# EAGLE schematic NavCom_Board_3 (EAGLE 7.2.0)
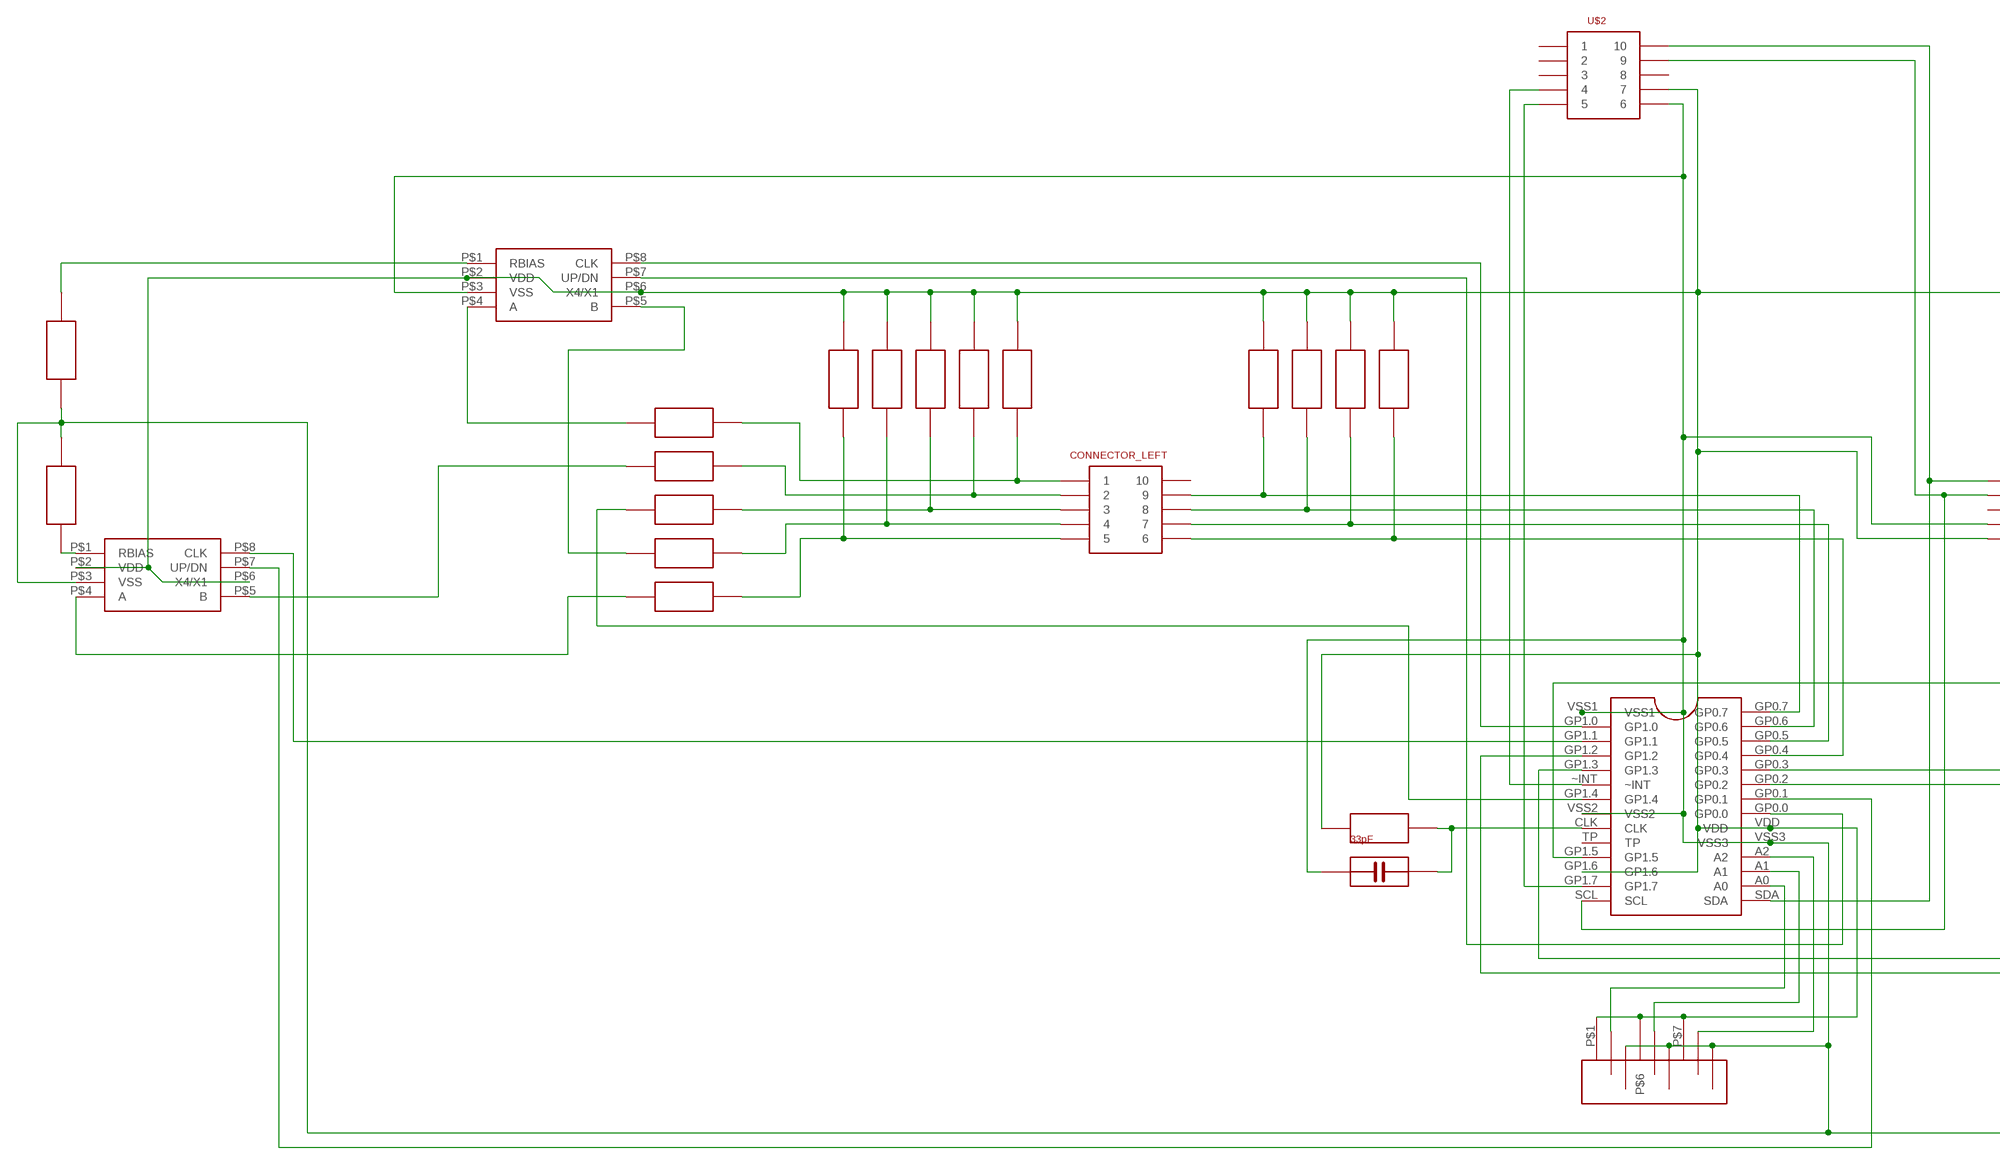
[diagram p0: schematic, sheet 1, part 1 of 2]
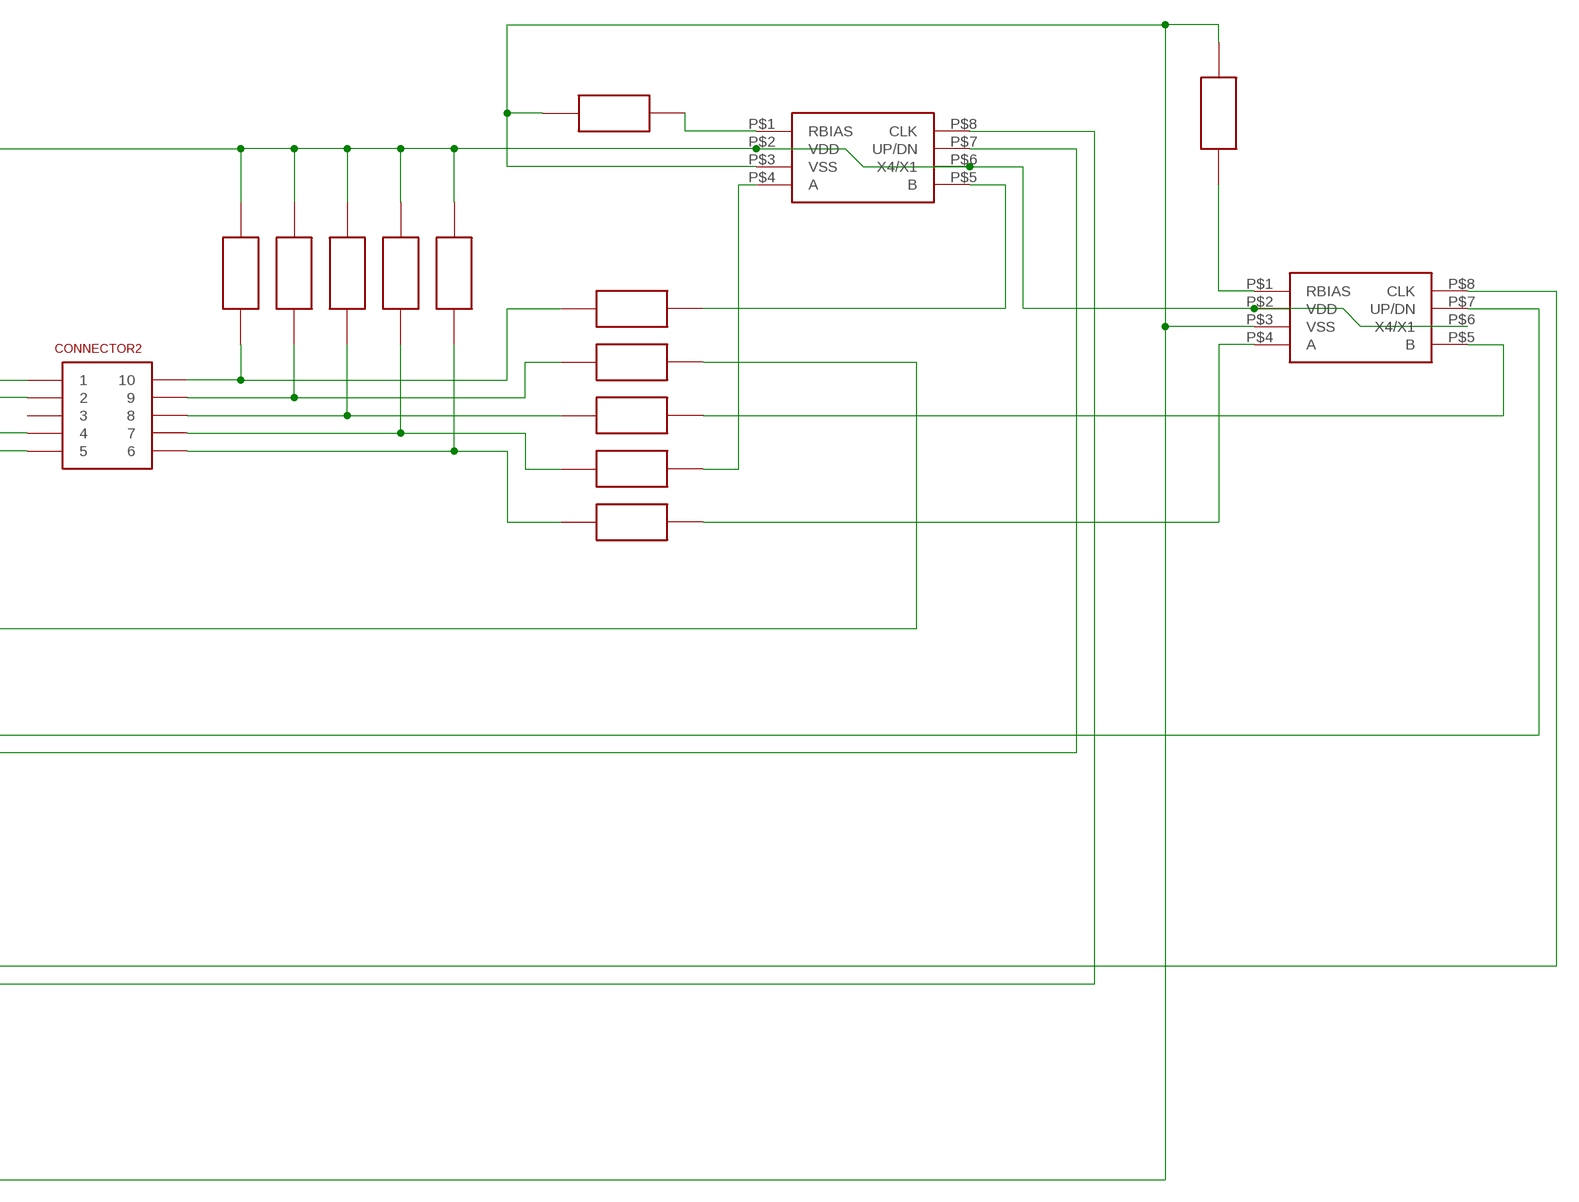
[diagram p1: schematic, sheet 1, part 2 of 2]

## Parts
33PF  33pF  KONDENZATOR  [KONDENZATOR]
CONNECTOR2  LISTA_2X5  [LISTA_2X5]
CONNECTOR_LEFT  LISTA_2X5  [LISTA_2X5]
U$1  MCP23016  [MCP23016]
U$2  LISTA_2X5  [LISTA_2X5]
U$3  LS7084  [LS7084]
U$4  LS7084  [LS7084]
U$5  LS7084  [LS7084]
U$6  LS7084  [LS7084]
U$7  REZISTOR  [REZISTOR]
U$8  REZISTOR  [REZISTOR]
U$9  REZISTOR  [REZISTOR]
U$10  REZISTOR  [REZISTOR]
U$11  ADRESA_0..2  [ADRESA_0..2]
U$12  REZISTOR  [REZISTOR]
U$13  REZISTOR  [REZISTOR]
U$14  REZISTOR  [REZISTOR]
U$15  REZISTOR  [REZISTOR]
U$16  REZISTOR  [REZISTOR]
U$17  REZISTOR  [REZISTOR]
U$18  REZISTOR  [REZISTOR]
U$19  REZISTOR  [REZISTOR]
U$20  REZISTOR  [REZISTOR]
U$21  REZISTOR  [REZISTOR]
U$22  REZISTOR  [REZISTOR]
U$23  3.9k  REZISTOR  [REZISTOR]
U$27  470M  REZISTOR  [REZISTOR]
U$29  REZISTOR  [REZISTOR]
U$30  REZISTOR  [REZISTOR]
U$31  REZISTOR  [REZISTOR]
U$32  REZISTOR  [REZISTOR]
U$33  REZISTOR  [REZISTOR]
U$34  470M  REZISTOR  [REZISTOR]
U$35  REZISTOR  [REZISTOR]
U$36  REZISTOR  [REZISTOR]
U$38  REZISTOR  [REZISTOR]
U$39  REZISTOR  [REZISTOR]
U$40  470M  REZISTOR  [REZISTOR]
U$41  470M  REZISTOR  [REZISTOR]

## Nets
N$1: CONNECTOR2.10 U$7.P$1 U$29.P$2
N$2: CONNECTOR2.9 U$9.P$1 U$30.P$2
N$3: CONNECTOR2.8 U$10.P$1 U$31.P$2
N$4: CONNECTOR2.6 U$12.P$1 U$33.P$2
N$5: U$5.P$4(A) U$33.P$1
N$6: CONNECTOR2.7 U$17.P$1 U$32.P$2
N$7: 33PF.P$1 CONNECTOR2.4 U$1.VSS1 U$1.VSS2 U$1.VSS3 U$2.6 U$3.P$3(VSS) U$4.P$3(VSS) U$5.P$3(VSS) U$6.P$3(VSS) U$11.P$3 U$11.P$4 U$11.P$9 U$27.P$2 U$34.P$1 U$40.P$1 U$41.P$1
N$8: CONNECTOR2.5 U$1.GP1.6 U$1.VDD U$2.7 U$3.P$2(VDD) U$3.P$6(X4/X1) U$4.P$2(VDD) U$4.P$6(X4/X1) U$5.P$2(VDD) U$5.P$6(X4/X1) U$6.P$2(VDD) U$6.P$6(X4/X1) U$7.P$2 U$8.P$1 U$9.P$2 U$10.P$2 U$11.P$1 U$11.P$6 U$11.P$7 U$12.P$2 U$13.P$1 U$14.P$1 U$15.P$1 U$16.P$1 U$17.P$2 U$18.P$1 U$19.P$1 U$20.P$1 U$21.P$1 U$23.P$1
N$9: CONNECTOR_LEFT.1 U$16.P$2 U$35.P$2
N$10: CONNECTOR_LEFT.2 U$13.P$2 U$36.P$2
N$11: U$1.GP1.4 U$22.P$1
N$12: CONNECTOR_LEFT.4 U$15.P$2 U$38.P$2
N$13: CONNECTOR_LEFT.5 U$18.P$2 U$39.P$2
N$14: U$6.P$4(A) U$39.P$1
N$15: U$4.P$4(A) U$32.P$1
N$16: CONNECTOR_LEFT.9 U$1.GP0.7 U$8.P$2
N$17: U$5.P$5(B) U$31.P$1
N$18: U$1.GP1.5 U$30.P$1
N$19: U$4.P$5(B) U$29.P$1
N$20: U$3.P$4(A) U$35.P$1
N$21: CONNECTOR_LEFT.3 U$14.P$2 U$22.P$2
N$22: U$4.P$1(RBIAS) U$27.P$1
N$23: U$6.P$5(B) U$36.P$1
N$24: U$1.GP0.2 U$4.P$7(UP/DN)
N$26: U$1.GP1.2 U$4.P$8(CLK)
N$28: U$1.A2 U$11.P$8
N$29: U$3.P$1(RBIAS) U$40.P$2
N$30: U$5.P$1(RBIAS) U$34.P$2
N$31: CONNECTOR_LEFT.8 U$1.GP0.6 U$19.P$2
N$32: U$1.GP0.3 U$5.P$7(UP/DN)
N$33: U$1.GP1.3 U$5.P$8(CLK)
N$34: U$1.GP1.0 U$3.P$8(CLK)
N$35: U$1.GP0.0 U$3.P$7(UP/DN)
N$36: U$1.GP1.1 U$6.P$8(CLK)
N$37: U$6.P$1(RBIAS) U$41.P$2
N$38: U$1.A1 U$11.P$5
N$39: U$1.GP0.1 U$6.P$7(UP/DN)
N$40: U$1.A0 U$11.P$2
N$41: 33PF.P$2 U$1.CLK U$23.P$2
N$42: CONNECTOR2.1 U$1.SDA U$2.10
N$43: CONNECTOR2.2 U$1.SCL U$2.9
N$45: U$1.~INT U$2.4
N$46: CONNECTOR_LEFT.7 U$1.GP0.5 U$20.P$2
N$47: U$1.GP1.7 U$2.5
N$48: CONNECTOR_LEFT.6 U$1.GP0.4 U$21.P$2
N$49: U$3.P$5(B) U$38.P$1
Unconnected: CONNECTOR2.3 CONNECTOR_LEFT.10 U$1.TP U$2.1 U$2.2 U$2.3 U$2.8

## Library data of the parts
33PF = RadioStack_v2:KONDENZATOR
CONNECTOR2 CONNECTOR_LEFT U$2 = RadioStack_v2:LISTA_2X5
U$1 = RadioStack_v2:MCP23016
U$3-U$6 = RadioStack_v2:LS7084
U$7-U$10 U$12-U$23 U$27 U$29-U$36 U$38-U$41 = RadioStack_v2:REZISTOR
U$11 = RadioStack_v2:ADRESA_0..2